# Altium schematic sheet Connector.SchDoc
size 420 x 297 mm; SheetNumber: 2; SheetTotal: 4
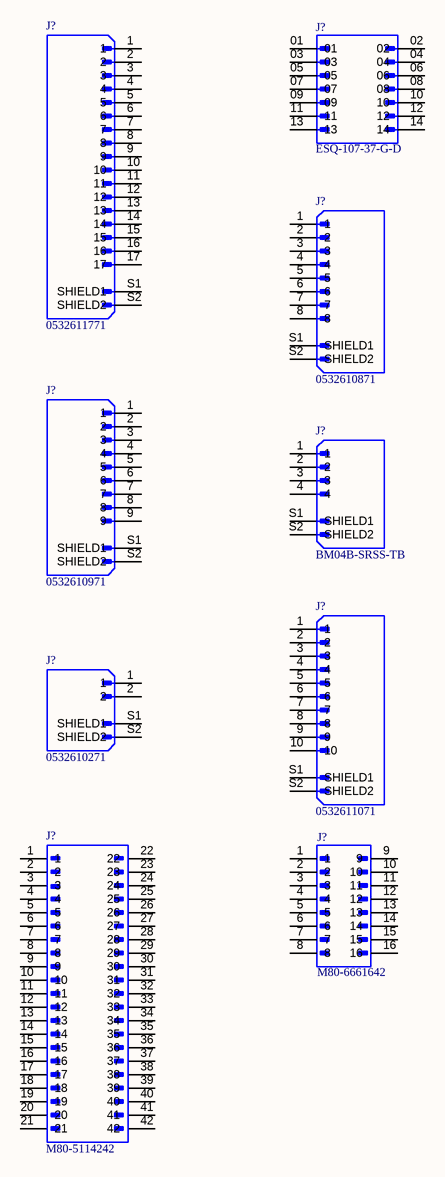
[diagram p0: Connector.SchDoc]

## Parts
(Parts that share a designator on the sheet are numbered #1, #2 ... from top to bottom, then left to right.)
J?#1  ESQ-107-37-G-D  [ESQ-107-37-G-D]
J?#2  0532611771
J?#3  0532610871  [0532610871]
J?#4  0532610971  [0532610971]
J?#5  BM04B-SRSS-TB  [BM04B-SRSS-TB]
J?#6  0532610271  [0532610271]
J?#7  0532611071  [0532611071]
J?#8  M80-6661642  [M80-6661642]
J?#9  M80-5114242  [M80-5114242]

## Nets

Not connected (* = marked no-connect by the designer): J?#1 01 02 03 04 05 06 07 08 09 10 11 12 13 14; J?#2 1 2 3 4 5 6 7 8 9 10 11 12 13 14 15 16 17 S1(SHIELD1) S2(SHIELD2); J?#3 1 2 3 4 5 6 7 8 S1(SHIELD1) S2(SHIELD2); J?#4 1 2 3 4 5 6 7 8 9 S1(SHIELD1) S2(SHIELD2); J?#5 1 2 3 4 S1(SHIELD1) S2(SHIELD2); J?#6 1 2 S1(SHIELD1) S2(SHIELD2); J?#7 1 2 3 4 5 6 7 8 9 10 S1(SHIELD1) S2(SHIELD2); J?#8 1 2 3 4 5 6 7 8 9 10 11 12 13 14 15 16; J?#9 1 2 3 4 5 6 7 8 9 10 11 12 13 14 15 16 17 18 19 20 21 22 23 24 25 26 27 28 29 30 31 32 33 34 35 36 37 38 39 40 41 42

## Notes on the sheet
- Project:
- PEE-PC1
- Sub-system:
- NANORACK_EXP_CONTROLLER
- Design by:
- SANG HUYNH
- BAO BUI Q.
- Sheet title:
- Sheet
- A3
- of
- Checked by:
- Approved by:
- VU PHAM
- Revision:
- Document No:
- V1.0.0
- Size:
- Date:

## Library data of the parts
J?#1 = CONN_TH_14: CONN SOCKET 14POS 0.1 GOLD PCB
J?#2 = CONN_SMD_17: CONN HEADER SMD R/A 17POS 1.25MM
J?#3 = CONN_SMD_08: CONN HEADER SMD R/A 8POS 1.25MM
J?#4 = CONN_SMD_09: CONN HEADER SMD R/A 9POS 1.25MM
J?#5 = CONN_SMD_04: CONN HEADER SMD 4POS 1MM
J?#6 = CONN_SMD_02: CONN HEADER SMD R/A 2POS 1.25MM
J?#7 = CONN_SMD_10: CONN HEADER SMD R/A 10POS 1.25MM
J?#8 = CONN_SMD_16: CONN HEADER SMD R/A 16POS 2MM
J?#9 = CONN_TH_42: CONN HEADER VERT 42POS 2MM